# Altium schematic sheet Accelerometer.SchDoc
size A
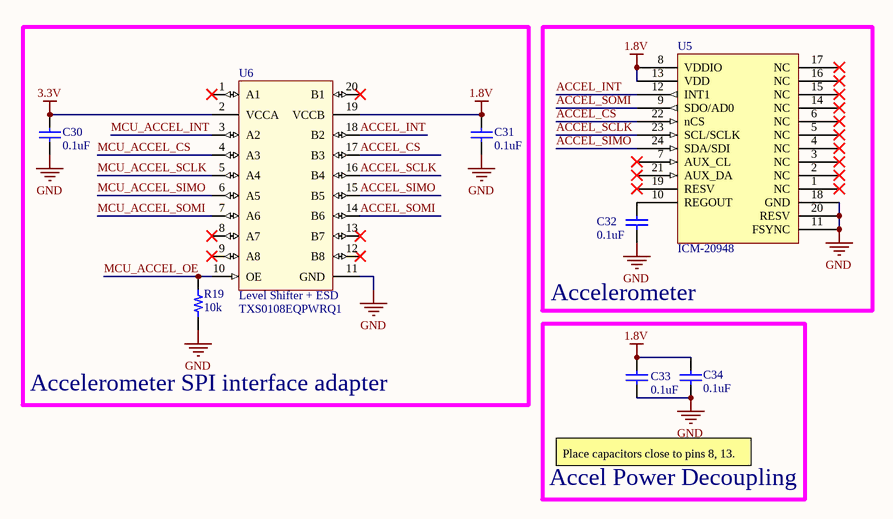
[diagram p0: Accelerometer.SchDoc]

## Parts
C30  value 0.1uF  [C0603]  (hidden comment: CAP CER 0603 0.1uF 50V C0G 10%)
C31  value 0.1uF  [C0603]  (hidden comment: CAP CER 0603 0.1uF 50V C0G 10%)
C32  value 0.1uF  [C0603]  (hidden comment: CAP CER 0603 0.1uF 50V C0G 10%)
C33  value 0.1uF  [C0603]  (hidden comment: CAP CER 0603 0.1uF 50V C0G 10%)
C34  value 0.1uF  [C0603]  (hidden comment: CAP CER 0603 0.1uF 50V C0G 10%)
R19  value 10k  [R0603]  (hidden comment: RES 0603 10k 1% 0.1W)
U5  ICM-20948  [QFN-24]
U6  Level Shifter + ESD  [PW (R-PDSO-G20)]

## Blocks framed on the sheet
Accelerometer SPI interface adapter: C30 C31 R19 U6
Accelerometer: C32 U5

## Nets
1.8V: C31.2 C33.2 C34.2 U5.8(VDDIO) U5.13(VDD) U6.19(VCCB)
3.3V: C30.2 U6.2(VCCA)
GND: C30.1 C31.1 C32.1 C33.1 C34.1 R19.1 U5.11(FSYNC) U5.18(GND) U5.20(RESV) U6.11(GND)
ACCEL_CS: U5.22(nCS) U6.17(B3)
ACCEL_INT: U5.12(INT1) U6.18(B2)
ACCEL_SCLK: U5.23(SCL/SCLK) U6.16(B4)
ACCEL_SIMO: U5.24(SDA/SDI) U6.15(B5)
ACCEL_SOMI: U5.9(SDO/AD0) U6.14(B6)
MCU_ACCEL_CS: U6.4(A3)
MCU_ACCEL_INT: U6.3(A2)
MCU_ACCEL_OE: R19.2 U6.10(OE)
MCU_ACCEL_SCLK: U6.5(A4)
MCU_ACCEL_SIMO: U6.6(A5)
MCU_ACCEL_SOMI: U6.7(A6)
NetC32_2: C32.2 U5.10(REGOUT)

Not connected (* = marked no-connect by the designer): U5 1(NC)* 2(NC)* 3(NC)* 4(NC)* 5(NC)* 6(NC)* 7(AUX_CL)* 14(NC)* 15(NC)* 16(NC)* 17(NC)* 19(RESV)* 21(AUX_DA)*; U6 1(A1)* 8(A7)* 9(A8)* 12(B8)* 13(B7)* 20(B1)*

## Notes on the sheet
- Accel Power Decoupling
- Place capacitors close to pins 8, 13.

## Library data of the parts
C30 C31 = CAP CER 0603 0.1uF 50V C0G 10%: 0.1uF ceramic capacitor; Manufacturer: TDK Corporation; Part_Number: CGA3E2X7R1H104K080AA; Supplier_Link: http://www.digikey.ca/product-detail/en/CGA3E2X7R1H104K080AA/445-5666-1-ND/2443706; Tolerance: 10%; Voltage rating: 50V; Price: 0.14; Supplier 1: Digi-Key; Supplier Part Number 1: 445-5666-1-ND
C32-C34 = CAP CER 0603 0.1uF 50V C0G 10%: 0.1uF ceramic capacitor; Manufacturer: Murata Electronics North America; Part_Number: GCM188R71H104KA57D; Supplier_Link: https://www.digikey.ca/product-detail/en/murata-electronics-north-america/GCM188R71H104KA57D/490-4779-1-ND/1641698; Tolerance: 10%; Voltage rating: 50V; Price: 0.45; Supplier 1: Digi-Key; Supplier Part Number 1: 490-4779-1-ND
R19 = RES 0603 10k 1% 0.1W: 10 kOhms 1% 0.1W Resistor; Manufacturer: Vishay Dale; Part_Number: CRCW060310K0FKEA; Supplier_Link: http://www.digikey.ca/product-detail/en/CRCW060310K0FKEA/541-10.0KHCT-ND/1179924; Power: 0.1W; Price_10: 0.125; Tolerance: 1%; Supplier 1: Digi-Key; Supplier Part Number 1: 541-10.0KHCT-ND
U5 = ICM-20948: IMU ACCEL/GYRO/COMPI2C/SPI 24QFN; Manufacturer: TDK InvenSense; Part_Number: ICM-20948; Supplier_Link: https://www.digikey.ca/product-detail/en/tdk-invensense/ICM-20948/1428-1123-1-ND/7062698
U6 = TXS0108EQPWRQ1: Voltage Level Translator, Bidirectional, 1 Circuit 8 Channel, 110Mbps, for Open-Drain and Push-Pull Applications, ESD Protection; Manufacturer: Texas Instruments; Supplier_Link: http://www.digikey.ca/product-detail/en/texas-instruments/TXS0108EQPWRQ1/296-42401-1-ND/5356982; Price: 3.69; Price_10: 3.317; Supplier 1: Digi-Key; Supplier Part Number 1: 296-42401-1-ND; Part_Number: TXS0108EQPWRQ1